# EAGLE design gate_multiplex (EAGLE 6.4)
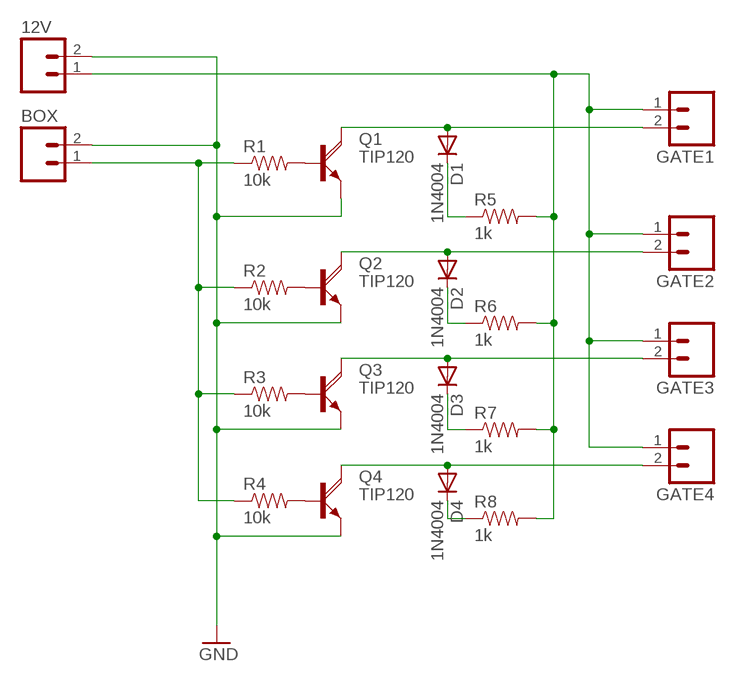
[diagram p0: schematic, sheet 1]

## Parts
12V  M02PTH  [1X02]
BOX  M02PTH  [1X02]
D1  1N4004  [DO41-10]
D2  1N4004  [DO41-10]
D3  1N4004  [DO41-10]
D4  1N4004  [DO41-10]
GATE1  M02PTH  [1X02]
GATE2  M02PTH  [1X02]
GATE3  M02PTH  [1X02]
GATE4  M02PTH  [1X02]
Q1  TIP120  [TO220V]
Q2  TIP120  [TO220V]
Q3  TIP120  [TO220V]
Q4  TIP120  [TO220V]
R1  10k  RESISTOR1206  [1206]
R2  10k  RESISTOR1206  [1206]
R3  10k  RESISTOR1206  [1206]
R4  10k  RESISTOR1206  [1206]
R5  1k  RESISTOR1206  [1206]
R6  1k  RESISTOR1206  [1206]
R7  1k  RESISTOR1206  [1206]
R8  1k  RESISTOR1206  [1206]

## Nets
GND: 12V.2 BOX.2 Q1.3(E) Q2.3(E) Q3.3(E) Q4.3(E)
N$1: D1.A GATE1.2 Q1.2(C)
N$2: D2.A GATE2.2 Q2.2(C)
N$3: D3.A GATE3.2 Q3.2(C)
N$4: D4.A GATE4.2 Q4.2(C)
N$5: BOX.1 R1.1 R2.1 R3.1 R4.1
N$6: Q2.1(B) R2.2
N$7: Q1.1(B) R1.2
N$8: Q3.1(B) R3.2
N$9: Q4.1(B) R4.2
N$11: 12V.1 GATE1.1 GATE2.1 GATE3.1 GATE4.1 R5.2 R6.2 R7.2 R8.2
N$12: D1.C R5.1
N$13: D2.C R6.1
N$14: D3.C R7.1
N$15: D4.C R8.1

## Library data of the parts
12V BOX GATE1-GATE4 = SparkFun-Connectors:M02: Header 2 Standard 2-pin 0.1" header. Use with straight break away headers (SKU : PRT-00116), right angle break away headers (PRT-00553), swiss pins (PRT-00743), machine pins (PRT-00117), and female headers (PRT-00115). Molex polarized connector foot print use with SKU : PRT-08233 with associated crimp pins and housings.
D1-D4 = diode:1N4004: DIODE general purpose rectifier, 1 A
Q1-Q4 = ucigate:TIP120: NPN DARLINGTON TRANSISTOR
R1-R8 = SparkFun-Resistors:RESISTOR: Resistor Basic schematic elements and footprints for 0603, 1206, and PTH resistors.

## Net classes
0 default: width 0.508 mm

## Board
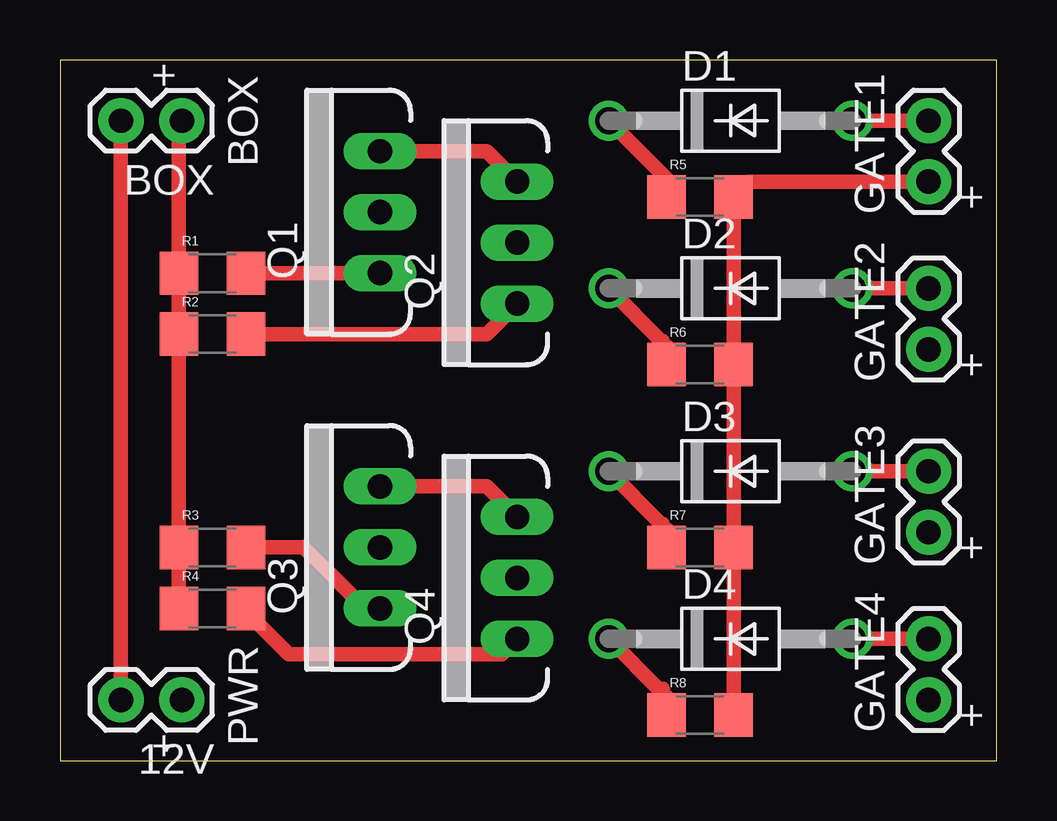
[diagram p1: board, top side]
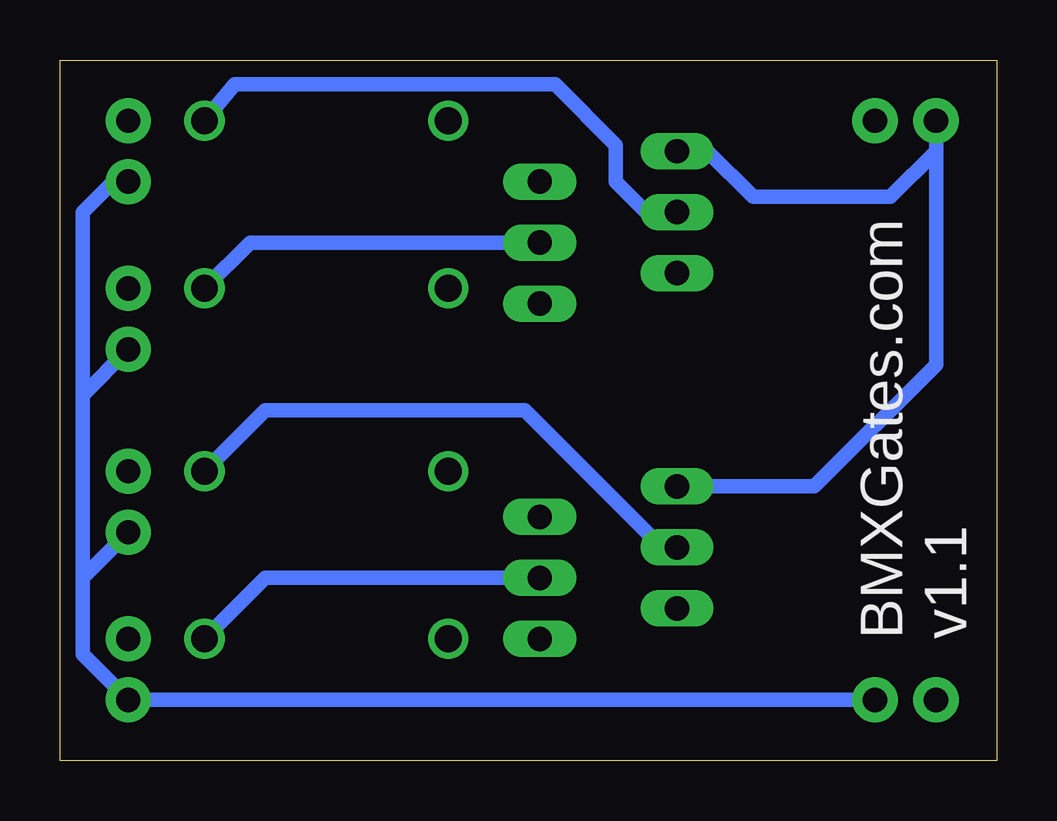
[diagram p2: board, bottom side, seen from below]

Size 39.04 x 29.2 mm. Coordinates in mm from the lower left corner, seen from the top.
Outline: 0,0 39.04,0 39.04,29.2 0,29.2 0,0
Copper layers (1*16): Top 0.0356mm / dielectric 1.5011mm / Bottom 0.0356mm
Design rules "LaenPCBOrder": minimum track width 6mil, minimum drill 13mil, track to track 6mil, track to pad 6mil, pad to pad 6mil, via to via 6mil, smd to smd 6mil, copper to edge 15mil, drill to drill 6mil, minimum pad ring 7mil, minimum via ring 7mil, stop-mask expansion 4mil, vias tented up to drill 0mil, thermal gap 10mil

### Footprints (pad centres in the part's own frame; a part is rotated, then mirrored left to right if it is on the bottom)
1X02 = drill 1.016 pad 1.88: 1 0,0; 2 2.54,0
DO41-10 = drill 1.118: A 5.08,0; C -5.08,0
TO220V = drill 1.016 long: 1 -2.54,0; 2 0,0; 3 2.54,0
1206 = smd 1.6 x 1.8: 1 -1.4,0; 2 1.4,0

### Placement (x,y rotation side)
12V  5.08,2.54 180 top
BOX  5.08,26.67 180 top
D1  27.94,26.67 0 top
D2  27.94,19.68 0 top
D3  27.94,12.06 0 top
D4  27.94,5.08 0 top
GATE1  36.2,24.13 90 top
GATE2  36.2,17.14 90 top
GATE3  36.2,9.53 90 top
GATE4  36.2,2.54 90 top
Q1  13.34,22.86 90 top
Q2  19.05,21.59 90 top
Q3  13.34,8.89 90 top
Q4  19.05,7.62 90 top
R1  6.35,20.32 0 top
R2  6.35,17.78 0 top
R3  6.35,8.89 0 top
R4  6.35,6.35 0 top
R5  26.67,23.5 0 top
R6  26.67,16.51 0 top
R7  26.67,8.89 0 top
R8  26.67,1.91 0 top

### Tracks (layer width: path | path; a pad name or v marks a point on that pad's centre or on a via)
GND
  Top 0.61: Q1.3 17.78,25.4 Q2.3 | BOX.2 12V.2 | Q4.3 17.78,11.43 Q3.3
  Bottom 0.61: Q3.3 7.62,11.43 2.54,16.51 2.54,25.4 | 2.54,25.4 BOX.2 | Q1.3 12.06,25.4 10.16,23.5 4.45,23.5 2.54,25.4
N$1
  Top 0.61: GATE1.2 D1.A
  Bottom 0.61: D1.A 31.75,28.19 18.41,28.19 15.88,25.65 15.88,24.13 14.61,22.86 Q1.2
N$2
  Top 0.61: GATE2.2 D2.A
  Bottom 0.61: Q2.2 31.11,21.59 D2.A
N$3
  Top 0.61: D3.A GATE3.2
  Bottom 0.61: D3.A 30.48,14.61 19.68,14.61 13.97,8.89 Q3.2
N$4
  Top 0.61: D4.A GATE4.2
  Bottom 0.61: D4.A 30.48,7.62 Q4.2
N$5
  Top 0.61: R4.1 R3.1 R2.1 R1.1 4.95,26.54 BOX.1
N$6
  Top 0.61: R2.2 17.78,17.78 Q2.1
N$7
  Top 0.61: R1.2 Q1.1
N$8
  Top 0.61: R3.2 10.16,8.89 12.7,6.35 Q3.1
N$9
  Top 0.61: Q4.1 18.41,4.45 9.53,4.45 8.26,5.71 8.26,5.84 R4.2
N$11
  Top 0.61: R8.2 R7.2 R6.2 R5.2 28.7,24.13 GATE1.1
  Bottom 0.61: 38.1,7.62 38.1,4.45 GATE4.1 12V.1 | 38.1,7.62 38.1,15.24 | 38.1,15.24 38.1,22.86 36.83,24.13 GATE1.1 | GATE3.1 38.1,7.62 | GATE2.1 38.1,15.24
N$12
  Top 0.508: 25.15,24.38 25.15,23.62 R5.1
  Top 0.61: D1.C 25.15,24.38 25.4,24.13
N$13
  Top 0.508: R6.1 25.15,16.76 25.15,17.53 25.08,17.46
  Top 0.61: D2.C 25.08,17.46 25.4,17.14
N$14
  Top 0.508: R7.1 25.15,9.14 25.15,9.91 25.08,9.84
  Top 0.61: D3.C 25.08,9.84 25.4,9.53
N$15
  Top 0.508: R8.1 25.15,2.29 25.15,3.05 25.02,2.92
  Top 0.61: D4.C 25.02,2.92 25.4,2.54

### Text on the board
tPlace: + | BOX | + | + | + | PWR | + | +
bPlace: BMXGates.com / v1.1